# Altium schematic sheet LeBot.SchDoc
size A4
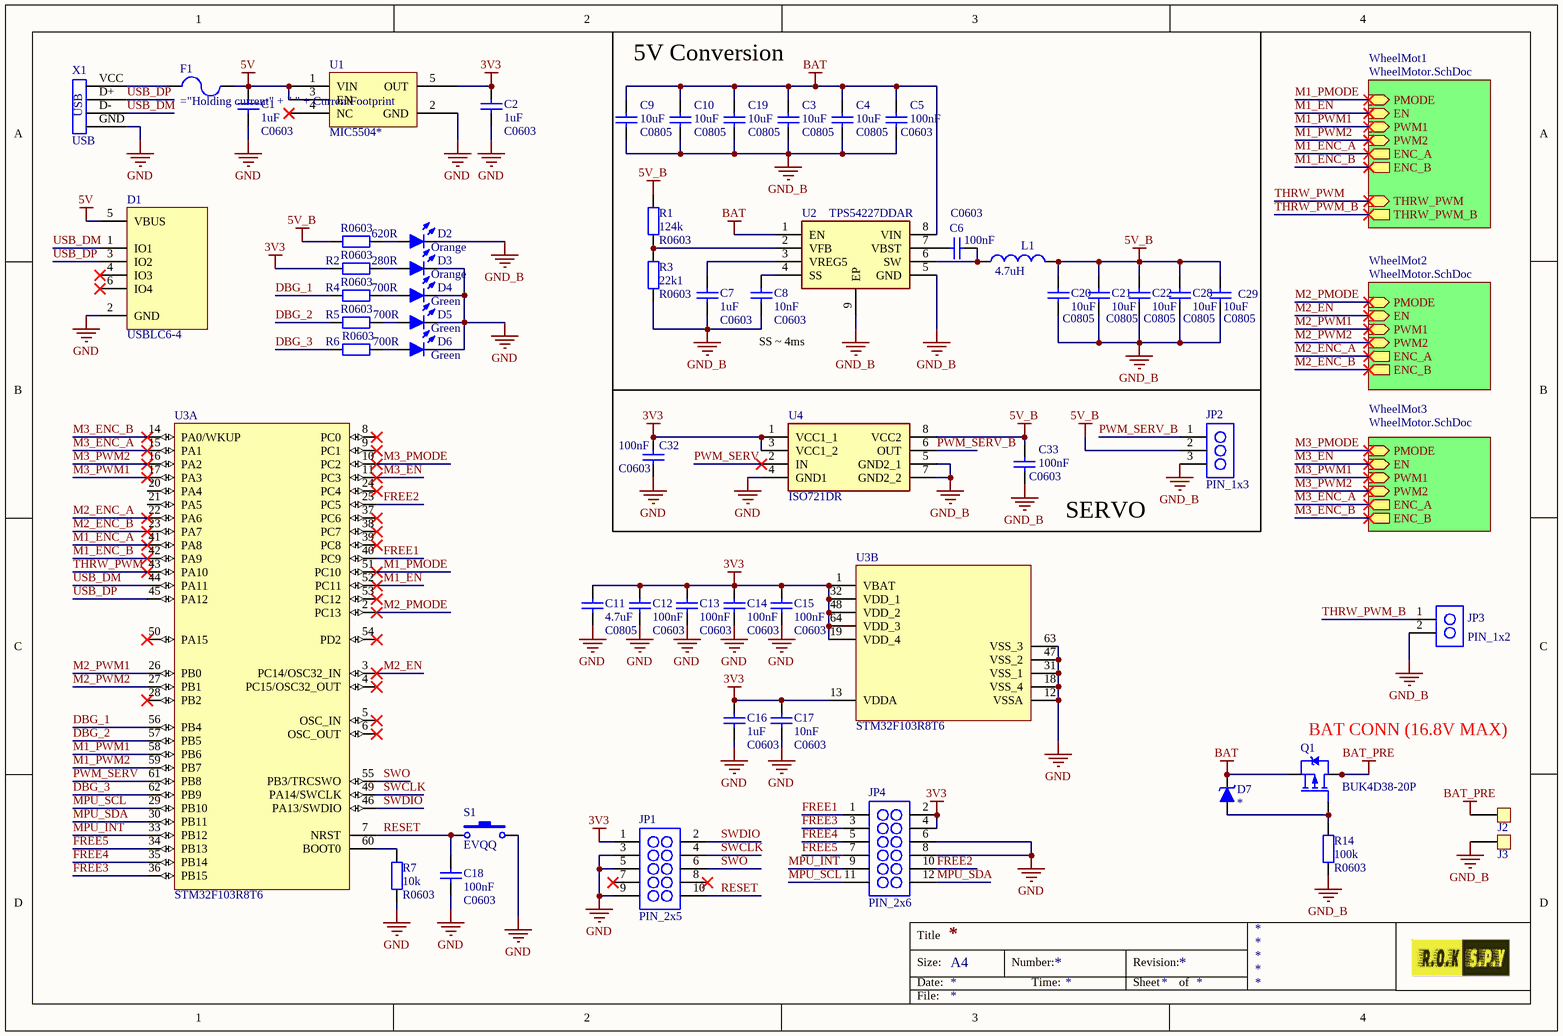
[diagram p0: LeBot.SchDoc]

## Parts
C1  Capacitance: 1uF  [C0603]
C2  Capacitance: 1uF  [C0603]
C3  Capacitance: 10uF  [C0805]
C4  Capacitance: 10uF  [C0805]
C5  Capacitance: 100nF  [C0603]
C6  Capacitance: 100nF  [C0603]
C7  Capacitance: 1uF  [C0603]
C8  Capacitance: 10nF  [C0603]
C9  Capacitance: 10uF  [C0805]
C10  Capacitance: 10uF  [C0805]
C11  Capacitance: 4.7uF  [C0805]
C12  Capacitance: 100nF  [C0603]
C13  Capacitance: 100nF  [C0603]
C14  Capacitance: 100nF  [C0603]
C15  Capacitance: 100nF  [C0603]
C16  Capacitance: 1uF  [C0603]
C17  Capacitance: 10nF  [C0603]
C18  Capacitance: 100nF  [C0603]
C19  Capacitance: 10uF  [C0805]
C20  Capacitance: 10uF  [C0805]
C21  Capacitance: 10uF  [C0805]
C22  Capacitance: 10uF  [C0805]
C28  Capacitance: 10uF  [C0805]
C29  Capacitance: 10uF  [C0805]
C32  Capacitance: 100nF  [C0603]
C33  Capacitance: 100nF  [C0603]
D1  USBLC6-4  [SOT-236]
D2  Colour: Orange  [LED_0805]
D3  Colour: Orange  [LED_0805]
D4  Colour: Green  [LED_0805]
D5  Colour: Green  [LED_0805]
D6  Colour: Green  [LED_0805]
D7  *  [SOT23-Zener]
F1  (no value)  [F1210]
J2  Connection_pad  [Wire_Pad]  (value not drawn)
J3  Connection_pad  [Wire_Pad]  (value not drawn)
JP1  PIN_2x5  [1.27_2X5H]
JP2  PIN_1x3  [1.27_1X3H]
JP3  PIN_1x2  [1.27_1X2H]
JP4  PIN_2x6  [1.27_2X6H]
L1  Inductance: 4.7uH  [L73]  (hidden comment: Inductor)
Q1  BUK4D38-20P  [PMPB12EPX]
R1  124k  [R0603]
R2  280R  [R0603]
R3  22k1  [R0603]
R4  700R  [R0603]
R5  700R  [R0603]
R6  700R  [R0603]
R7  10k  [R0603]
R8  620R  [R0603]
R14  100k  [R0603]
S1  EVQQ  [EVQQ]
U1  MIC5504*  [SOT-235]
U2  TPS54227DDAR  [SOIC127P600X175-8N]
U3  STM32F103R8T6  [QFP50P1200X1200X160-64N]  (parts A,B of 2)
U4  ISO721DR  [SOIC127P600X175-8N]
X1  USB  [USB MicroB Type 2.0]

## Sub-sheets
WheelMot1 = WheelMotor.SchDoc: PMODE (in), EN (in), PWM2 (in), ENC_A (out), PWM1 (in), ENC_B (out), THRW_PWM (in), THRW_PWM_B (out)
WheelMot2 = WheelMotor.SchDoc: PMODE (in), EN (in), PWM2 (in), ENC_A (out), PWM1 (in), ENC_B (out)
WheelMot3 = WheelMotor.SchDoc: PMODE (in), EN (in), PWM2 (in), ENC_A (out), PWM1 (in), ENC_B (out)

## Nets
3V3: C2.2 C11.2 C12.2 C13.2 C14.2 C15.2 C16.2 C17.2 C32.2 JP1.1 JP4.2 JP4.4 R2.2 U1.5(OUT) U3.1(VBAT) U3.13(VDDA) U3.19(VDD_4) U3.32(VDD_1) U3.48(VDD_2) U3.64(VDD_3) U4.1(VCC1_1) U4.3(VCC1_2)
5V: C1.2 D1.5(VBUS) F1.2 U1.1(VIN) U1.3(EN)
5V_B: C20.2 C21.2 C22.2 C28.2 C29.2 C33.2 JP2.2 L1.2 R1.2 R8.2 U4.8(VCC2)
BAT: C3.2 C4.2 C5.2 C9.2 C10.2 C19.2 D7.2(K) Q1.1(S) U2.1(EN) U2.8(VIN)
BAT_PRE: J2.1 Q1.3(D) Q1.D0(D) Q1.D1(D) Q1.D2(D)
GND: C1.1 C2.1 C11.1 C12.1 C13.1 C14.1 C15.1 C16.1 C17.1 C18.1 C32.1 D1.2(GND) D3.2(K) D4.2(K) D5.2(K) D6.2(K) JP1.3 JP1.5 JP1.9 JP4.6 JP4.8 R7.1 S1.2 U1.2(GND) U3.12(VSSA) U3.18(VSS_4) U3.31(VSS_1) U3.47(VSS_2) U3.63(VSS_3) U4.4(GND1) X1.GND
GND_B: C3.1 C4.1 C5.1 C7.1 C8.1 C9.1 C10.1 C19.1 C20.1 C21.1 C22.1 C28.1 C29.1 C33.1 D2.2(K) J3.1 JP2.3 JP3.2 R3.1 R14.2 U2.5(GND) U2.9(EP) U4.5(GND2_1) U4.7(GND2_2)
DBG_1: R4.2 U3.56(PB4)
DBG_2: R5.2 U3.57(PB5)
DBG_3: R6.2 U3.62(PB9)
FREE1: JP4.1 U3.40(PC9)
FREE2: JP4.10 U3.25(PC5)
FREE3: JP4.3 U3.36(PB15)
FREE4: JP4.5 U3.35(PB14)
FREE5: JP4.7 U3.34(PB13)
M1_EN: U3.52(PC11) ; sheet WheelMot1/EN
M1_ENC_A: U3.41(PA8) ; sheet WheelMot1/ENC_A
M1_ENC_B: U3.42(PA9) ; sheet WheelMot1/ENC_B
M1_PMODE: U3.51(PC10) ; sheet WheelMot1/PMODE
M1_PWM1: U3.58(PB6) ; sheet WheelMot1/PWM1
M1_PWM2: U3.59(PB7) ; sheet WheelMot1/PWM2
M2_EN: U3.3(PC14/OSC32_IN) ; sheet WheelMot2/EN
M2_ENC_A: U3.22(PA6) ; sheet WheelMot2/ENC_A
M2_ENC_B: U3.23(PA7) ; sheet WheelMot2/ENC_B
M2_PMODE: U3.2(PC13) ; sheet WheelMot2/PMODE
M2_PWM1: U3.26(PB0) ; sheet WheelMot2/PWM1
M2_PWM2: U3.27(PB1) ; sheet WheelMot2/PWM2
M3_EN: U3.11(PC3) ; sheet WheelMot3/EN
M3_ENC_A: U3.15(PA1) ; sheet WheelMot3/ENC_A
M3_ENC_B: U3.14(PA0/WKUP) ; sheet WheelMot3/ENC_B
M3_PMODE: U3.10(PC2) ; sheet WheelMot3/PMODE
M3_PWM1: U3.17(PA3) ; sheet WheelMot3/PWM1
M3_PWM2: U3.16(PA2) ; sheet WheelMot3/PWM2
MPU_INT: JP4.9 U3.33(PB12)
MPU_SCL: JP4.11 U3.29(PB10)
MPU_SDA: JP4.12 U3.30(PB11)
PWM_SERV: U3.61(PB8) U4.2(IN)
PWM_SERV_B: JP2.1 U4.6(OUT)
RESET: C18.2 JP1.10 S1.1 U3.7(NRST)
SWCLK: JP1.4 U3.49(PA14/SWCLK)
SWDIO: JP1.2 U3.46(PA13/SWDIO)
SWO: JP1.6 U3.55(PB3/TRCSWO)
THRW_PWM: U3.43(PA10) ; sheet WheelMot1/THRW_PWM
THRW_PWM_B: JP3.1 ; sheet WheelMot1/THRW_PWM_B
USB_DM: D1.1(IO1) U3.44(PA11) X1.D-
USB_DP: D1.3(IO2) U3.45(PA12) X1.D+
NetC6_1: C6.1 L1.1 U2.6(SW)
NetC6_2: C6.2 U2.7(VBST)
NetC7_2: C7.2 U2.3(VREG5)
NetC8_2: C8.2 U2.4(SS)
NetD2_1: D2.1(A) R8.1
NetD3_1: D3.1(A) R2.1
NetD4_1: D4.1(A) R4.1
NetD5_1: D5.1(A) R5.1
NetD6_1: D6.1(A) R6.1
NetD7_1: D7.1(A) Q1.2(G) R14.1
NetF1_1: F1.1 X1.VCC
NetR1_1: R1.1 R3.2 U2.2(VFB)
NetR7_2: R7.2 U3.60(BOOT0)

Not connected (* = marked no-connect by the designer): D1 4(IO3)* 6(IO4)*; JP1 7* 8*; U1 4(NC)*; U3 4(PC15/OSC32_OUT)* 5(OSC_IN)* 6(OSC_OUT)* 8(PC0)* 9(PC1)* 20(PA4) 21(PA5) 24(PC4)* 28(PB2)* 37(PC6)* 38(PC7)* 39(PC8)* 50(PA15)* 53(PC12)* 54(PD2)*

## Notes on the sheet
- 5V Conversion
- SS ~ 4ms
- SERVO
- (near Q1) BAT CONN (16.8V MAX)
- Title
- Size:
- Date:
- A4
- Number:
- Time:
- Revision:
- Sheet
- of
- File:

## Library data of the parts
C1-C22 C28 C29 C32 C33 = Capacitor: Ceramic capacitor; Type: MLCC; Voltage rating: *V; ComponentLinknDescription: Datasheet; Characteristic: *; Manufacturer: *; ComponentLinknURL: *
  C1 C2 C5-C8 C12-C18 C32 C33: Note: C0603
  C3 C4 C9-C11 C19-C22 C28 C29: Note: C0805
D1 = USBLC6-4: USB ESD Protection; Manufacturer: ST Microelectronics; ComponentLinknDescription: Datasheet; Space heritage: false; Verified: false; Part number: USBLC6-4
D2 D3 = LED: Light Emitting Diode; Part number: MC011368; ComponentLinknDescription: Datasheet; Forward Voltage: 2.1V; Space heritage: false; Forward Current: 20mA; Power dissipation: false; Farnell Order Nr: 3015159
D4-D6 = LED: Light Emitting Diode; Part number: KP-2012LSGC; ComponentLinknDescription: Datasheet; Forward Voltage: 1.9V; Space heritage: false; Forward Current: 2mA; Power dissipation: false; Farnell Order Nr: 2463991
D7 = Zener Diode: PartNumber: *; Parameter 3: *; Parameter 4: *; Farnell Order Nr: *; Zener Voltage: *; Parameter 2: *
F1 = Fuse: Operating voltage: *V; Initial resistance: *R; Carrying current: *A; ComponentLinknDescription: Datasheet; Type: *; Manufacturer: *; Tripping current: *A; Holding current: *A; ComponentLinknURL: *; Comment_1: *; Note: ="Holding current" + " " + CurrentFootprint
L1 = Inductor: Saturation current: *A; DC resistance: *R; Self resonant frequency: *Hz; ComponentLinknDescription: Datasheet; Core material: *; RMS current: *A; Construction: *; ComponentLinknURL: *; Manufacturer: *; Note: =Inductance + " " + CurrentFootprint
Q1 = P-Channel MOSFET: GS breakdown Volt: 12V/-12V; DS Breakdown Volt: -20V; Drain Current: -18A; rDSon: 30mOhm; PartNumber: BUK4D38-20P; Farnell Order Nr: 3526152; Mouser Order Nr: 771-BUK4D38-20PX; Datasheet: https://eu.mouser.com/datasheet/2/916/BUK4D38-20P-1880069.pdf; Parameter 1: *
R1-R8 R14 = Resistor: Precision: *%; Voltage rating: *V; Temp coefficient: *ppm; Power rating: *mW; ComponentLinknDescription: Datasheet; Manufacturer: *; ComponentLinknURL: *; Note: R0603
  R1: Resistance: 124k
  R2: Resistance: 280R
  R3: Resistance: 22k1
  R4-R6: Resistance: 700R
  R7: Resistance: 10k
  R8: Resistance: 620R
  R14: Resistance: 100k
S1 = EVQQ: Switch; Manufacturer: Panasonic; ComponentLinknDescription: Datasheet; Space heritage: false; Drawn by: Erik Ilbis; Verified: false; Part number: EVQQ
U1 = MIC5504: Low-dropout voltage regulator; Manufacturer: Microchip/Micrel; Space heritage: false; Current Rating: 300 mA; Input Voltage: 2V5 to 5V5; Accuracy: 2%; Part number: MIC5504; Verified: false; Drawn by: Roberts Oskars Komarovskis; ComponentLink1Description: Datasheet; ComponentLink1URL: https://www.mouser.ee/datasheet/2/268/MIC550X-1082389.pdf; Package Type: *
U2 = TPS54227DDAR: 4.5-V to 18-V Input, 2-A SynchronousStep-DownConverter; Manufacturer_Name: Texas Instruments; Datasheet Link: http://www.ti.com/lit/gpn/tps54227; Height: 1.7mm; Manufacturer_Part_Number: TPS54227DDAR; PartNumber: TPS54227DDAR; Farnell Order Nr: 3007320
U3 = STM32F103R8T6: Medium-density performance line ARM®-based 32-bit MCU with 64 or 128 KB Flash, USB, CAN, 7 timers, 2 ADCs, 9 com. interfaces; PartNumber: STM32F103R8T6; Drawn By: Roberts Oskars Komarovskis; Farnell Order Nr: 3129750; ComponentLink1Description: Datasheet; ComponentLink1URL: https://4donline.ihs.com/images/VipMasterIC/IC/SGST/SGST-S-A0001117293/SGST-S-A0001117293-1.pdf?hkey=6D3A4C79FDBF58556ACFDE234799DDF0
U4 = ISO721DR: SO72xSingleChannelHigh-SpeedDigitalIsolators; Manufacturer_Name: Texas Instruments; Datasheet Link: http://www.ti.com/lit/gpn/ISO721; Height: 1.75mm; Manufacturer_Part_Number: ISO721DR; Farnell Order Nr: 3124779; PartNumber: ISO721DR
JP1 = PIN_2x5: Manufacturer: *; Part Number: *; ComponentLinknDescription: *; ComponentLinknURL: *; Drawn By: Erik Ilbis
JP2 = PIN_1x3: Manufacturer: *; Part Number: *; ComponentLinknDescription: *; ComponentLinknURL: *; Drawn By: Erik Ilbis
JP3 = PIN_1x2: Manufacturer: *; Part Number: *; ComponentLinknURL: *; Drawn By: Erik Ilbis; ComponentLinknDescription: *
JP4 = PIN_2x6: Manufacturer: *; Part Number: *; ComponentLinknDescription: *; ComponentLinknURL: *; Drawn By: Erik Ilbis